# Altium schematic sheet MCU.SchDoc
size A
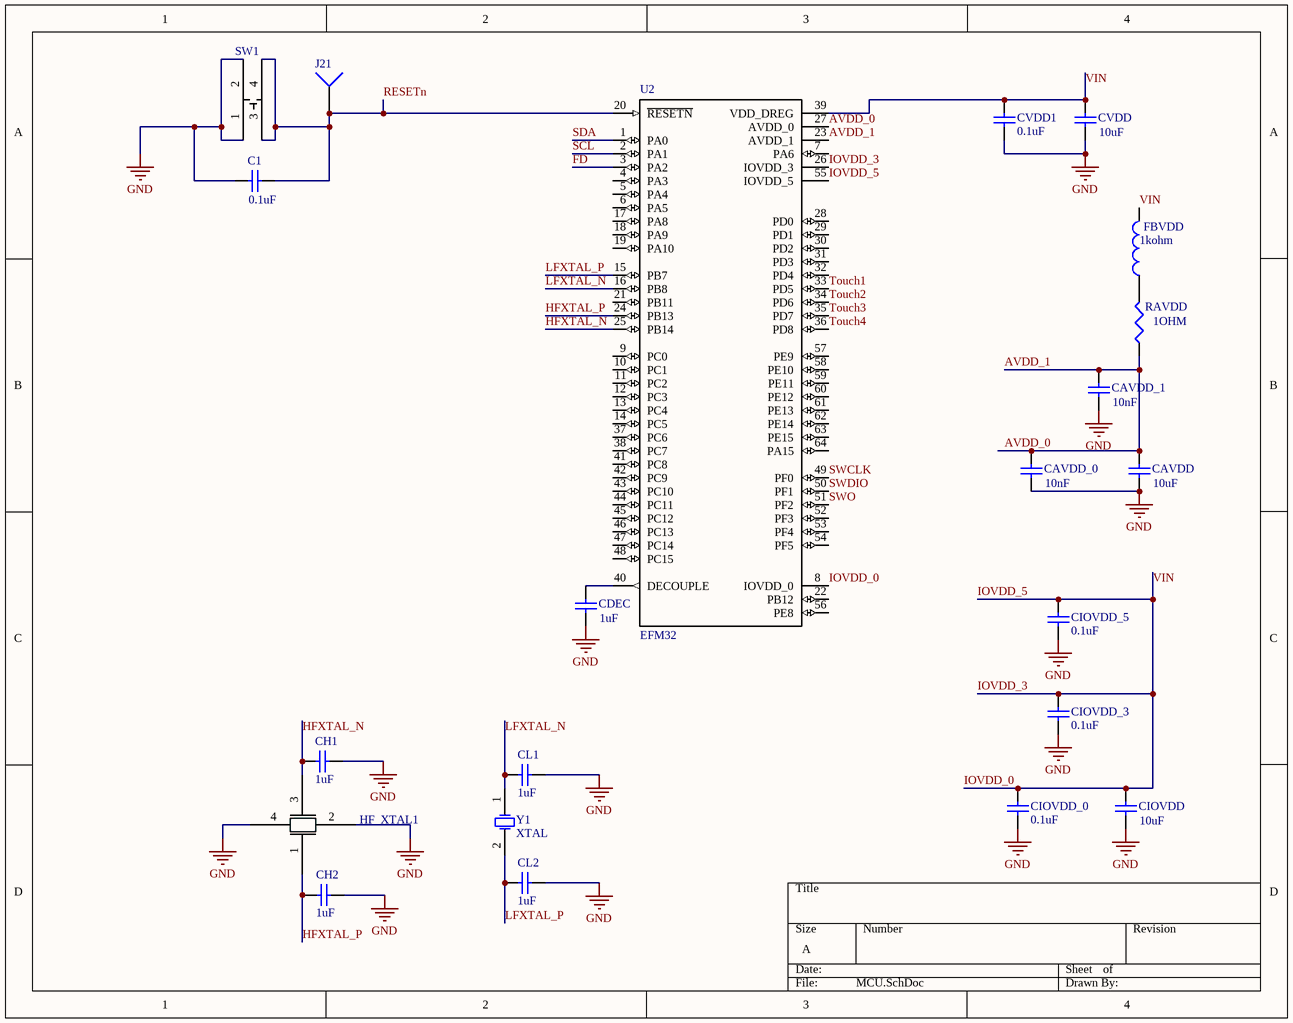
[diagram p0: MCU.SchDoc]

## Parts
C1  value 0.1uF  [C1206]  (hidden comment: Cap Semi)
CAVDD  value 10uF  [C1206]  (hidden comment: Cap Semi)
CAVDD_0  value 10nF  [C1206]  (hidden comment: Cap Semi)
CAVDD_1  value 10nF  [C1206]  (hidden comment: Cap Semi)
CDEC  value 1uF  [C1206]  (hidden comment: Cap Semi)
CH1  value 1uF  [C1206]  (hidden comment: Cap Semi)
CH2  value 1uF  [C1206]  (hidden comment: Cap Semi)
CIOVDD  value 10uF  [C1206]  (hidden comment: Cap Semi)
CIOVDD_0  value 0.1uF  [C1206]  (hidden comment: Cap Semi)
CIOVDD_3  value 0.1uF  [C1206]  (hidden comment: Cap Semi)
CIOVDD_5  value 0.1uF  [C1206]  (hidden comment: Cap Semi)
CL1  value 1uF  [C1206]  (hidden comment: Cap Semi)
CL2  value 1uF  [C1206]  (hidden comment: Cap Semi)
CVDD  value 10uF  [C1206]  (hidden comment: Cap Semi)
CVDD1  value 0.1uF  [C1206]  (hidden comment: Cap Semi)
FBVDD  value 1kohm  [0402-A]  (hidden comment: Inductor)
HF_XTAL1  Crystal_OSC  [HFXTAL]  (value not drawn)
J21  Socket  [PIN1]  (value not drawn)
RAVDD  value 1OHM  [J1-0603]  (hidden comment: Res3)
SW1  Switch-PTS645  [Switch]  (value not drawn)
U2  EFM32  [QFN-64]
Y1  XTAL  [R38]

## Nets
GND: C1.1 CAVDD.1 CAVDD_0.1 CAVDD_1.1 CDEC.1 CH1.1 CH2.1 CIOVDD.1 CIOVDD_0.1 CIOVDD_3.1 CIOVDD_5.1 CL1.1 CL2.2 CVDD.1 CVDD1.1 HF_XTAL1.2 HF_XTAL1.4 SW1.1 SW1.2
AVDD_0: CAVDD.2 CAVDD_0.2 CAVDD_1.2 RAVDD.1 U2.23(AVDD_1) U2.27(AVDD_0)  [also labelled AVDD_1]
FD: U2.3(PA2)
HFXTAL_N: CH1.2 HF_XTAL1.3 U2.25(PB14)
HFXTAL_P: CH2.2 HF_XTAL1.1 U2.24(PB13)
IOVDD_0: CIOVDD.2 CIOVDD_0.2 CIOVDD_3.2 CIOVDD_5.2 CVDD.2 CVDD1.2 FBVDD.2 U2.8(IOVDD_0) U2.26(IOVDD_3) U2.39(VDD_DREG) U2.55(IOVDD_5)  [also labelled IOVDD_3, IOVDD_5, VIN]
LFXTAL_N: CL1.2 U2.16(PB8) Y1.1(OSC1)
LFXTAL_P: CL2.1 U2.15(PB7) Y1.2(OSC2)
RESETn: C1.2 J21.1 SW1.3 SW1.4 U2.20(~{RESETN})
SCL: U2.2(PA1)
SDA: U2.1(PA0)
SWCLK: U2.49(PF0)
SWDIO: U2.50(PF1)
SWO: U2.51(PF2)
Touch1: U2.33(PD5)
Touch2: U2.34(PD6)
Touch3: U2.35(PD7)
Touch4: U2.36(PD8)
NetCDEC_2: CDEC.2 U2.40(DECOUPLE)
NetFBVDD_1: FBVDD.1 RAVDD.2

Not connected (* = marked no-connect by the designer): U2 4(PA3) 5(PA4) 6(PA5) 7(PA6) 9(PC0) 10(PC1) 11(PC2) 12(PC3) 13(PC4) 14(PC5) 17(PA8) 18(PA9) 19(PA10) 21(PB11) 22(PB12) 28(PD0) 29(PD1) 30(PD2) 31(PD3) 32(PD4) 37(PC6) 38(PC7) 41(PC8) 42(PC9) 43(PC10) 44(PC11) 45(PC12) 46(PC13) 47(PC14) 48(PC15) 52(PF3) 53(PF4) 54(PF5) 56(PE8) 57(PE9) 58(PE10) 59(PE11) 60(PE12) 61(PE13) 62(PE14) 63(PE15) 64(PA15)

## Library data of the parts
C1 CIOVDD_0 CIOVDD_3 CIOVDD_5 CVDD1 = Cap Semi: CAP CER 0.1UF 16V Y5V 0603; Manufacturer: Samsung Electro-Mechanics; Manufacturer Part Number: CL10F104ZO8NNNC; Digi-Key Part Number: 1276-1258-1-ND
CAVDD CIOVDD CVDD = Cap Semi: CL10A106MQ8NNNC; Manufacturer: Samsung Electro-Mechanics; Digi-Key Part Number: 1276-1119-1-ND; Manufacturer Part Number: CL10A106MQ8NNNC
CAVDD_0 CAVDD_1 = Cap Semi: CAP CER 10000PF 100V X7R 0603; Manufacturer: TDK Corporation; Manufacturer Part Number: C1608X7R2A103M080AA; Digi-Key Part Number: 445-1305-1-ND
CDEC CH1 CH2 CL1 CL2 = Cap Semi: CAP CER 1UF 16V X7R 0603; Manufacturer: Samsung Electro-Mechanics; Manufacturer Part Number: CL10B105MO8NNWC; Digi-Key Part Number: 1276-6524-1-ND
FBVDD = Inductor: FERRITE BEAD 1 KOHM 0603 1LN; Manufacturer: Wurth Electronics Inc.; Manufacturer Part Number: 74279266; Digi-Key Part Number: 732-4484-1-ND
HF_XTAL1 = Crystal_OSC: Manufacturer: Kyocera International Inc. Electronic Components; Manufacturer Part Number: CX2016DB40000D0FLJCC; Digi-Key Part Number: 1253-1120-1-ND; Component URL: https://media.digikey.com/pdf/Data%20Sheets/Optrex%20PDFs/CX2016DB_Series_Spec.pdf; Component URL Description: Datasheet
RAVDD = Res3: RES SMD 1 OHM 1% 1/10W 0603; Manufacturer: Yageo; Manufacturer Part Number: RC0603FR-071RL; Digi-Key Part Number: 311-1.00HRCT-ND
SW1 = Switch-PTS645: SWITCH TACTILE SPST-NO 0.05A 12V; Manufacturer: C&K; Manufacturer Part Number: PTS645SM43SMTR92 LFS; Digi-Key Part Number: CKN9112CT-ND; Component URL: http://www.ckswitches.com/media/1471/pts645.pdf; Component URL Description: Datasheet
U2 = EFM32G232F128-QFP64: IC MCU 32BIT 64KB FLASH 64QFN; Manufacturer: Silicon Labs; Manufacturer Part Number: EFM32LG840F64G-E-QFN64R; Digi-Key Part Number: 336-4841-1-ND
Y1 = XTAL: CRYSTAL 32.7680KHZ 7PF SMD; Manufacturer: Abracon LLC; Manufacturer Part Number: ABS07-32.768KHZ-7-T; Digi-Key Part Number: 535-9543-1-ND; DatasheetLink: https://abracon.com/Resonators/ABS07.pdf
J21 = Socket: LatestRevisionDate: 17-Jul-2002; LatestRevisionNote: Re-released for DXP Platform.; Publisher: Altium Limited